# EAGLE design 2 rain oca 2020 (EAGLE 9.5.2)
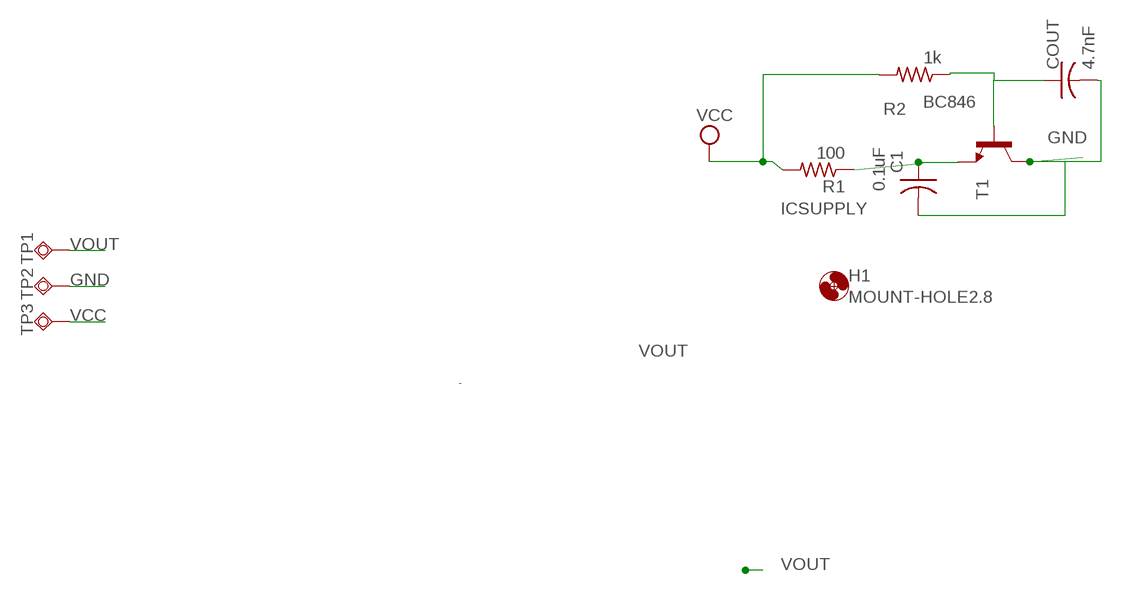
[diagram p0: schematic, sheet 1]

## Parts
C1  0.1uF  C-USC0402  [C0402]
COUT  4.7nF  C-USC0402  [C0402]
H1  MOUNT-HOLE2.8  [2,8]
R1  100  R-US_R0603  [R0603]
R2  1k  R-US_R0603  [R0603]
T1  BC846  [SOT23]
TP1  TPSQTP20SQ  [TP20SQ]
TP2  TPSQTP20SQ  [TP20SQ]
TP3  TPSQTP20SQ  [TP20SQ]

## Nets
GND: C1.2 COUT.2 T1.3(C) TP2.TP
ICSUPPLY: C1.1 R1.1 T1.2(E)
VCC: R1.2 R2.2 TP3.TP
VOUT: COUT.1 R2.1 T1.1(B) TP1.TP

## Library data of the parts
C1 COUT = rcl:C-US: CAPACITOR, American symbol; SPICEPREFIX: C
H1 = holes:MOUNT-HOLE: MOUNTING HOLE with drill center marker
R1 R2 = rcl:R-US_: RESISTOR, American symbol; SPICEPREFIX: R
T1 = transistor:BC846: NPN TRANSISTOR
TP1-TP3 = testpad:TPSQ: Test pad

## Board
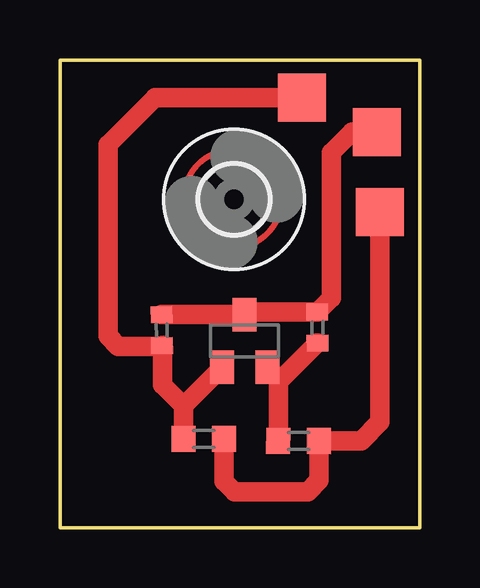
[diagram p1: board, top side]

Size 15 x 19.5 mm. Coordinates in mm from the lower left corner, seen from the top.
Outline: 0,19.5 15,19.5 15,0 0,0 0,19.5
Copper layers (1*16): Top 0.035mm / dielectric 1.5mm / Bottom 0.035mm
Design rules "default": minimum track width 6mil, minimum drill 0.35mm, track to track 6mil, track to pad 6mil, pad to pad 6mil, via to via 6mil, smd to smd 6mil, copper to edge 40mil, drill to drill 6mil, minimum pad ring 10mil, minimum via ring 8mil, stop-mask expansion 4mil, vias tented up to drill 0mil, thermal gap 10mil

### Footprints (pad centres in the part's own frame; a part is rotated, then mirrored left to right if it is on the bottom)
C0402 = smd 0.7 x 0.9: 1 -0.65,0; 2 0.65,0
2,8 = hole 2.8: 0,0
R0603 = smd 1 x 1.1: 1 -0.85,0; 2 0.85,0
SOT23 = smd 1 x 1.4: 1 -0.95,-1.1; 2 0.95,-1.1; 3 0,1.1
TP20SQ = smd 2 x 2: TP 0,0

### Placement (x,y rotation side)
C1  10.74,8.34 90.4 top
COUT  4.25,8.24 90.8 top
H1  7.26,13.69 0 top
R1  9.96,3.61 359.9 top
R2  6,3.7 0 top
T1  7.7,7.78 0 top
TP1  10.1,17.93 0 top
TP2  13.23,16.5 0 top
TP3  13.35,13.16 0 top

### Tracks (layer width: path | path; a pad name or v marks a point on that pad's centre or on a via)
GND
  Top 0.406: TP2.TP 12.76,16.5 | T1.3 7.81,8.99
  Top 0.813: TP2.TP 12.18,16.5 11.32,15.64 11.32,9.57 C1.2 7.81,8.99 | T1.3 COUT.2
ICSUPPLY
  Top 0.813: T1.2 9.07,6.26 9.07,6.13 9.11,6.13 | 9.11,6.13 R1.1 | C1.1 9.19,6.13 9.11,6.13
VCC
  Top 0.813: 13.42,13.16 TP3.TP 13.35,4.4 12.56,3.61 R1.2 10.8,1.96 10.34,1.5 7.27,1.5 6.85,1.92 R2.2
  Top 0.9: 10.92,3.5 R1.2 | 13.8,12.71 TP3.TP
VOUT
  Top 0.406: TP1.TP
  Top 0.813: T1.1 5.15,5.08 | 5.15,5.08 R2.1 | 5.15,5.08 4.29,5.94 4.29,7.55 | 4.29,7.55 COUT.1 | TP1.TP 3.96,17.93 2,15.97 2,7.98 2.43,7.55 4.29,7.55
(copper drawn outside any net)
  shapes: Top circle x1